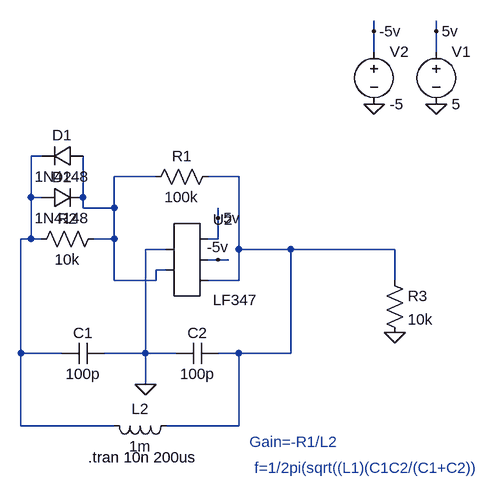
[diagram p0: schematic Draft1.asc]
Draft1.asc, the LTspice schematic file:
Version 4
SHEET 1 880 680
WIRE 176 -336 176 -352
WIRE 272 -336 272 -352
WIRE 176 -304 176 -336
WIRE 272 -304 272 -336
WIRE -336 -144 -352 -144
WIRE -160 -112 -224 -112
WIRE -32 -112 -80 -112
WIRE -352 -80 -352 -144
WIRE -336 -80 -352 -80
WIRE -272 -80 -272 -144
WIRE -272 -64 -272 -80
WIRE -224 -64 -224 -112
WIRE -224 -64 -272 -64
WIRE -64 -48 -64 -64
WIRE -352 -16 -352 -80
WIRE -352 -16 -368 -16
WIRE -336 -16 -352 -16
WIRE -224 -16 -224 -64
WIRE -224 -16 -256 -16
WIRE -64 -16 -64 -48
WIRE -64 -16 -80 -16
WIRE -144 0 -176 0
WIRE -32 0 -32 -112
WIRE 48 0 -32 0
WIRE 208 0 48 0
WIRE -64 16 -80 16
WIRE -48 16 -64 16
WIRE -144 32 -160 32
WIRE -224 48 -224 -16
WIRE -160 48 -160 32
WIRE -160 48 -224 48
WIRE -32 48 -32 0
WIRE -32 48 -80 48
WIRE 208 48 208 0
WIRE -368 160 -368 -16
WIRE -304 160 -368 160
WIRE -176 160 -176 0
WIRE -176 160 -240 160
WIRE -128 160 -176 160
WIRE -32 160 -64 160
WIRE 48 160 48 0
WIRE 48 160 -32 160
WIRE -176 208 -176 160
WIRE -368 272 -368 160
WIRE -224 272 -368 272
WIRE -32 272 -32 160
WIRE -32 272 -144 272
FLAG -176 208 0
FLAG 208 128 0
FLAG 272 -224 0
FLAG 272 -336 5v
FLAG 176 -224 0
FLAG 176 -336 -5v
FLAG -64 -48 5v
FLAG -64 16 -5v
SYMBOL Res -64 -128 R90
WINDOW 0 0 56 VBottom 2
WINDOW 3 32 56 VTop 2
SYMATTR InstName R1
SYMATTR Value 100k
SYMBOL Res -240 -32 R90
WINDOW 0 0 56 VBottom 2
WINDOW 3 32 56 VTop 2
SYMATTR InstName R2
SYMATTR Value 10k
SYMBOL Res 192 32 R0
SYMATTR InstName R3
SYMATTR Value 10k
SYMBOL Voltage 272 -320 R0
SYMATTR InstName V1
SYMATTR Value 5
SYMBOL Voltage 176 -320 R0
SYMATTR InstName V2
SYMATTR Value -5
SYMBOL Cap -240 144 R90
WINDOW 0 0 32 VBottom 2
WINDOW 3 32 32 VTop 2
SYMATTR InstName C1
SYMATTR Value 100p
SYMBOL Cap -64 144 R90
WINDOW 0 0 32 VBottom 2
WINDOW 3 32 32 VTop 2
SYMATTR InstName C2
SYMATTR Value 100p
SYMBOL ind -128 256 R90
WINDOW 0 5 56 VBottom 2
WINDOW 3 32 56 VTop 2
SYMATTR InstName L2
SYMATTR Value 1m
SYMBOL diode -272 -160 R90
WINDOW 0 0 32 VBottom 2
WINDOW 3 32 32 VTop 2
SYMATTR InstName D1
SYMATTR Value 1N4148
SYMBOL diode -336 -64 R270
WINDOW 0 32 32 VTop 2
WINDOW 3 0 32 VBottom 2
SYMATTR InstName D2
SYMATTR Value 1N4148
SYMBOL AutoGenerated/LF347 -112 16 R0
SYMATTR InstName U2
TEXT -16 296 Left 2 ;Gain=-R1/L2
TEXT -8 336 Left 2 ;f=1/2pi(sqrt((L1)(C1C2/(C1+C2))
TEXT -264 320 Left 2 !.tran 10n 200us

The netlist it stands for:
* Draft1.asc
R1 N003 N002 100k
R2 N002 N001 10k
R3 N003 0 10k
V1 5v 0 5
V2 -5v 0 -5
C1 0 N001 100p
C2 N003 0 100p
L2 N003 N001 1m
D1 N002 N001 1N4148
D2 N001 N002 1N4148
* U2: LF347 (symbol AutoGenerated/LF347 not available, pins judged from their places): pin1=0 pin2=N002 pin3=5v pin4=-5v pin5=N003
.model D D
.lib standard.dio
* Gain=-R1/L2
* f=1/2pi(sqrt((L1)(C1C2/(C1+C2))
.tran 10n 200us
.backanno
.end